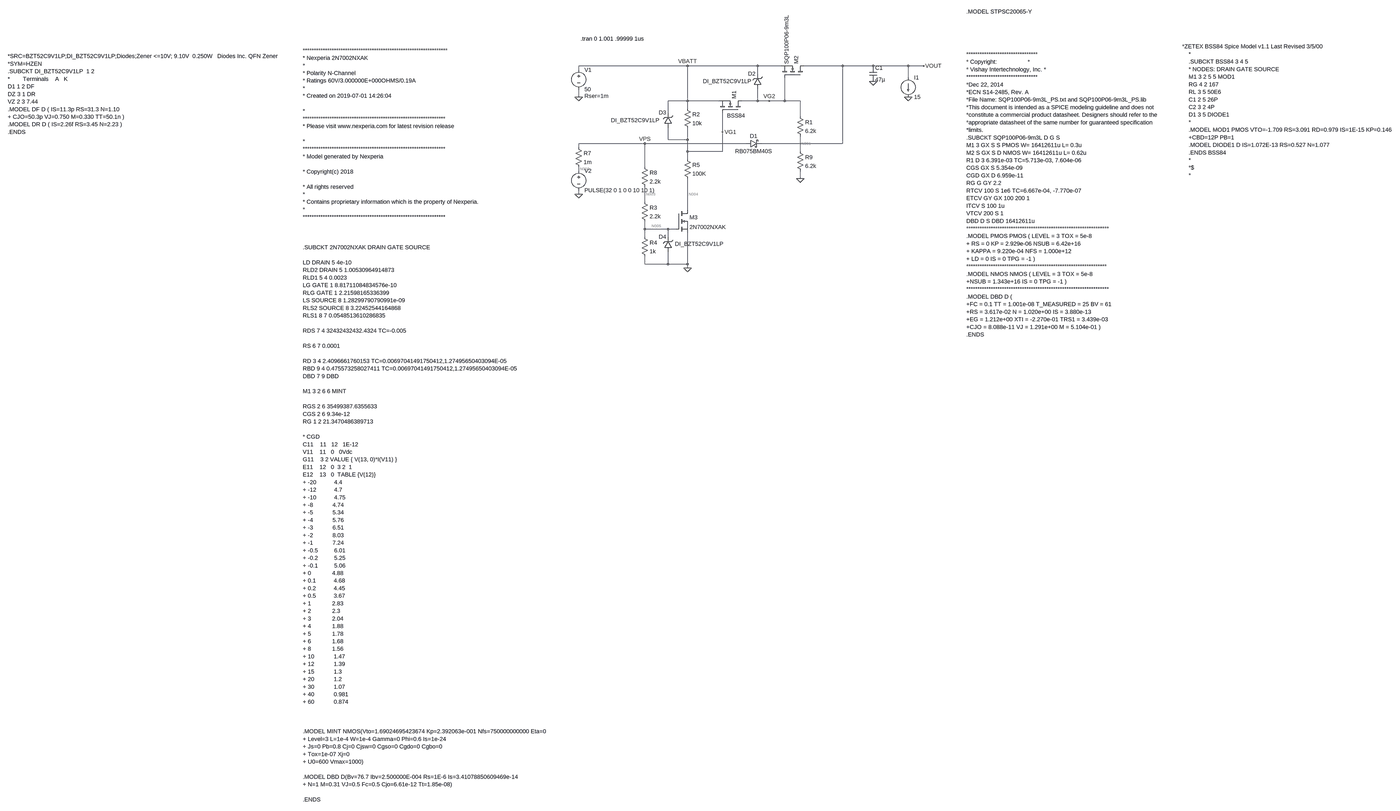
[diagram p0: schematic switching_scheme.asc, whole sheet]
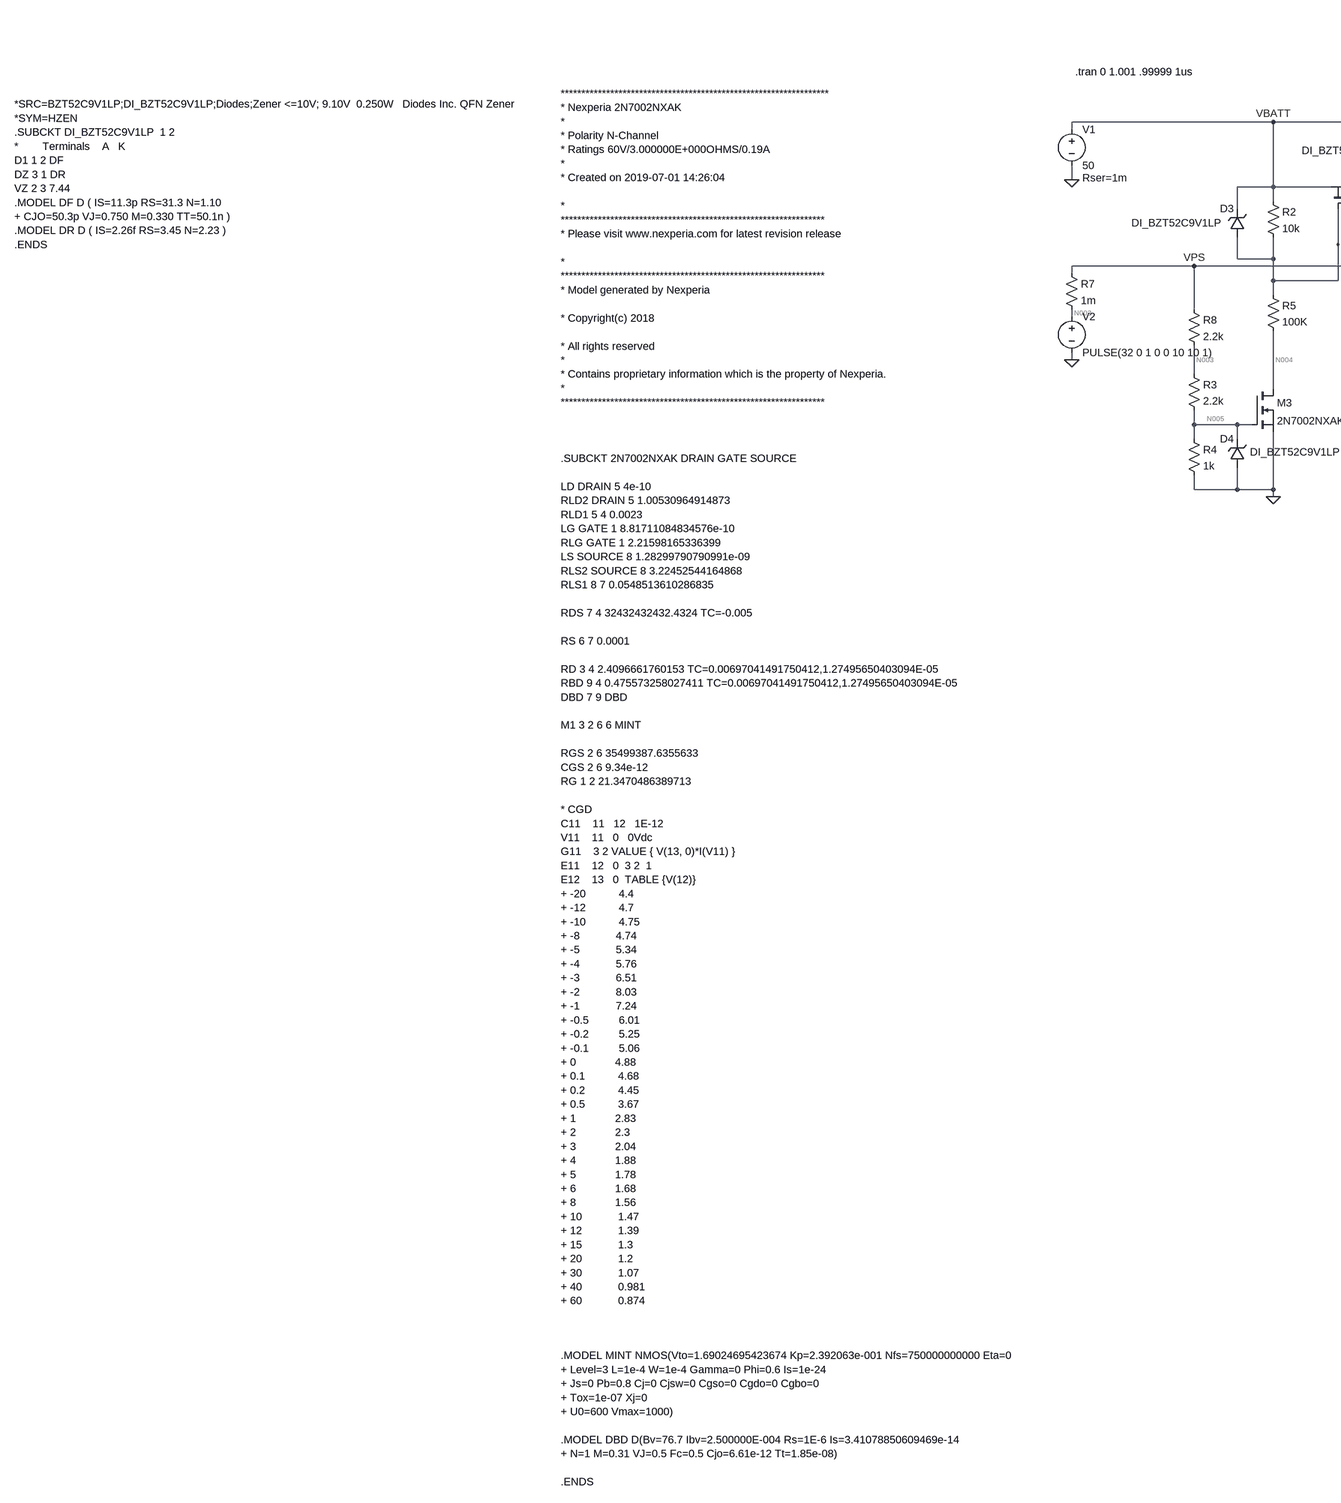
[diagram p1: schematic switching_scheme.asc, part, row 1 of 1, column 1 of 2]
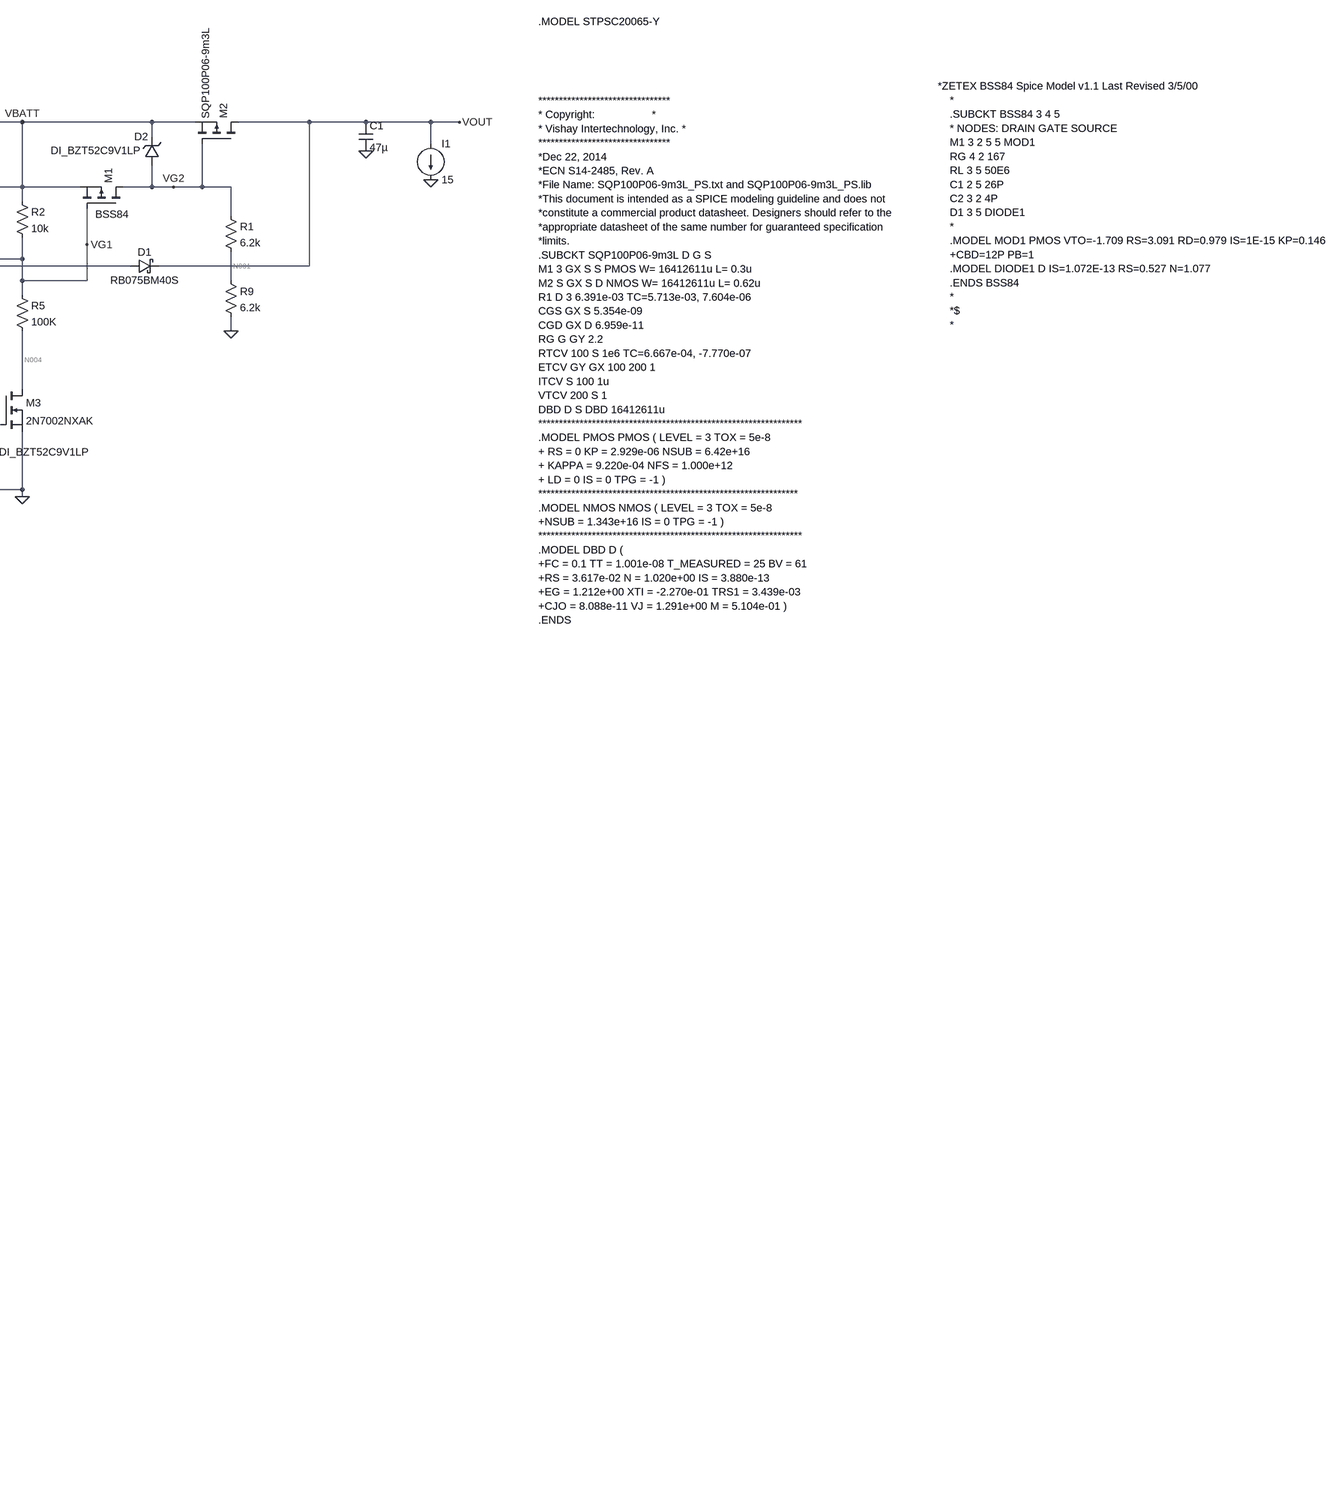
[diagram p2: schematic switching_scheme.asc, part, row 1 of 1, column 2 of 2]
switching_scheme.asc, the LTspice schematic file:
Version 4
SHEET 1 4012 91732
WIRE -176 48 -624 48
WIRE 112 48 -176 48
WIRE 208 48 112 48
WIRE 544 48 304 48
WIRE 688 48 544 48
WIRE 832 48 688 48
WIRE 896 48 832 48
WIRE -624 64 -624 48
WIRE 112 80 112 48
WIRE 832 96 832 48
WIRE -624 176 -624 144
WIRE -176 192 -176 48
WIRE -176 192 -256 192
WIRE -48 192 -176 192
WIRE 112 192 112 144
WIRE 112 192 48 192
WIRE 160 192 112 192
WIRE 224 192 224 96
WIRE 224 192 160 192
WIRE 288 192 224 192
WIRE -176 224 -176 192
WIRE -256 240 -256 192
WIRE 288 256 288 192
WIRE -32 320 -32 240
WIRE -256 352 -256 304
WIRE -176 352 -176 304
WIRE -176 352 -256 352
WIRE -352 368 -624 368
WIRE 64 368 -352 368
WIRE 544 368 544 48
WIRE 544 368 128 368
WIRE -624 384 -624 368
WIRE -176 400 -176 352
WIRE -32 400 -32 320
WIRE -32 400 -176 400
WIRE 288 400 288 336
WIRE -176 432 -176 400
WIRE -352 464 -352 368
WIRE -624 480 -624 464
WIRE 288 512 288 480
WIRE -624 576 -624 560
WIRE -352 608 -352 544
WIRE -176 640 -176 512
WIRE -352 720 -352 688
WIRE -256 720 -352 720
WIRE -224 720 -256 720
WIRE -352 752 -352 720
WIRE -256 752 -256 720
WIRE -352 864 -352 832
WIRE -256 864 -256 816
WIRE -256 864 -352 864
WIRE -176 864 -176 736
WIRE -176 864 -256 864
WIRE -176 880 -176 864
FLAG -176 880 0
FLAG 288 512 0
FLAG -624 576 0
FLAG -624 176 0
FLAG 896 48 VOUT
FLAG -176 48 VBATT
FLAG -352 368 VPS
FLAG 832 176 0
FLAG 160 192 VG2
FLAG -32 320 VG1
FLAG 688 112 0
DATAFLAG 16 368 ""
DATAFLAG 560 48 ""
DATAFLAG 128 48 ""
DATAFLAG 288 192 ""
DATAFLAG -160 192 ""
DATAFLAG -176 848 ""
DATAFLAG -336 720 ""
DATAFLAG -176 400 ""
DATAFLAG 288 512 ""
SYMBOL res 272 240 R0
SYMATTR InstName R1
SYMATTR Value 6.2k
SYMBOL res -192 208 R0
SYMATTR InstName R2
SYMATTR Value 10k
SYMBOL res -368 592 R0
SYMATTR InstName R3
SYMATTR Value 2.2k
SYMBOL res -368 736 R0
SYMATTR InstName R4
SYMATTR Value 1k
SYMBOL voltage -624 464 R0
WINDOW 123 0 0 Left 0
WINDOW 39 0 0 Left 0
SYMATTR InstName V2
SYMATTR Value PULSE(32 0 1 0 0 10 10 1)
SYMBOL pmos 304 96 M270
SYMATTR InstName M2
SYMATTR Value SQP100P06-9m3L
SYMATTR Prefix X
SYMBOL schottky 64 384 R270
WINDOW 0 32 32 VTop 2
WINDOW 3 0 32 VBottom 2
SYMATTR InstName D1
SYMATTR Value RB075BM40S
SYMATTR Description Diode
SYMATTR Type diode
SYMBOL pmos 48 240 M270
WINDOW 3 -13 62 VLeft 2
SYMATTR Value BSS84
SYMATTR InstName M1
SYMATTR Prefix X
SYMBOL voltage -624 48 R0
WINDOW 123 0 0 Left 0
WINDOW 39 24 124 Left 2
SYMATTR SpiceLine Rser=1m
SYMATTR InstName V1
SYMATTR Value 50
SYMBOL nmos -224 640 R0
SYMATTR InstName M3
SYMATTR Value 2N7002NXAK
SYMATTR Prefix X
SYMBOL zener 128 144 R180
WINDOW 0 24 64 Left 2
WINDOW 3 41 33 Left 2
SYMATTR InstName D2
SYMATTR Value DI_BZT52C9V1LP
SYMATTR Prefix X
SYMBOL zener -240 304 R180
WINDOW 0 24 64 Left 2
WINDOW 3 52 32 Left 2
SYMATTR InstName D3
SYMATTR Value DI_BZT52C9V1LP
SYMATTR Prefix X
SYMBOL zener -240 816 R180
WINDOW 0 24 64 Left 2
WINDOW 3 -212 35 Left 2
SYMATTR InstName D4
SYMATTR Value DI_BZT52C9V1LP
SYMATTR Prefix X
SYMBOL res -192 416 R0
SYMATTR InstName R5
SYMATTR Value 100K
SYMBOL res -640 368 R0
SYMATTR InstName R7
SYMATTR Value 1m
SYMBOL cap 672 48 R0
SYMATTR InstName C1
SYMATTR Value 47µ
SYMBOL res -368 448 R0
SYMATTR InstName R8
SYMATTR Value 2.2k
SYMBOL res 272 384 R0
SYMATTR InstName R9
SYMATTR Value 6.2k
SYMBOL current 832 96 R0
WINDOW 123 0 0 Left 0
WINDOW 39 0 0 Left 0
SYMATTR InstName I1
SYMATTR Value 15
TEXT -616 -64 Left 2 !.tran 0 1.001 .99999 1us
TEXT 1128 0 Left 2 !********************************\n* Copyright:                   *\n* Vishay Intertechnology, Inc. *\n********************************\n*Dec 22, 2014\n*ECN S14-2485, Rev. A\n*File Name: SQP100P06-9m3L_PS.txt and SQP100P06-9m3L_PS.lib\n*This document is intended as a SPICE modeling guideline and does not\n*constitute a commercial product datasheet. Designers should refer to the\n*appropriate datasheet of the same number for guaranteed specification\n*limits.\n.SUBCKT SQP100P06-9m3L D G S \nM1 3 GX S S PMOS W= 16412611u L= 0.3u \nM2 S GX S D NMOS W= 16412611u L= 0.62u \nR1 D 3 6.391e-03 TC=5.713e-03, 7.604e-06 \nCGS GX S 5.354e-09 \nCGD GX D 6.959e-11 \nRG G GY 2.2\nRTCV 100 S 1e6 TC=6.667e-04, -7.770e-07 \nETCV GY GX 100 200 1 \nITCV S 100 1u \nVTCV 200 S 1 \nDBD D S DBD 16412611u \n**************************************************************** \n.MODEL PMOS PMOS ( LEVEL = 3 TOX = 5e-8 \n+ RS = 0 KP = 2.929e-06 NSUB = 6.42e+16 \n+ KAPPA = 9.220e-04 NFS = 1.000e+12 \n+ LD = 0 IS = 0 TPG = -1 ) \n*************************************************************** \n.MODEL NMOS NMOS ( LEVEL = 3 TOX = 5e-8 \n+NSUB = 1.343e+16 IS = 0 TPG = -1 ) \n**************************************************************** \n.MODEL DBD D ( \n+FC = 0.1 TT = 1.001e-08 T_MEASURED = 25 BV = 61 \n+RS = 3.617e-02 N = 1.020e+00 IS = 3.880e-13 \n+EG = 1.212e+00 XTI = -2.270e-01 TRS1 = 3.439e-03 \n+CJO = 8.088e-11 VJ = 1.291e+00 M = 5.104e-01 ) \n.ENDS
TEXT 1128 -176 Left 2 !.MODEL STPSC20065-Y
TEXT -1776 -16 Left 2 !*****************************************************************\n* Nexperia 2N7002NXAK\n*\n* Polarity N-Channel\n* Ratings 60V/3.000000E+000OHMS/0.19A\n*\n* Created on 2019-07-01 14:26:04 \n \n*\n****************************************************************\n* Please visit www.nexperia.com for latest revision release\n \n*\n****************************************************************\n* Model generated by Nexperia\n \n* Copyright(c) 2018\n \n* All rights reserved\n*\n* Contains proprietary information which is the property of Nexperia.\n*\n****************************************************************\n \n\n \n.SUBCKT 2N7002NXAK DRAIN GATE SOURCE\n \nLD DRAIN 5 4e-10\nRLD2 DRAIN 5 1.00530964914873\nRLD1 5 4 0.0023\nLG GATE 1 8.81711084834576e-10\nRLG GATE 1 2.21598165336399\nLS SOURCE 8 1.28299790790991e-09\nRLS2 SOURCE 8 3.22452544164868\nRLS1 8 7 0.0548513610286835\n \nRDS 7 4 32432432432.4324 TC=-0.005\n \nRS 6 7 0.0001\n \nRD 3 4 2.4096661760153 TC=0.00697041491750412,1.27495650403094E-05\nRBD 9 4 0.475573258027411 TC=0.00697041491750412,1.27495650403094E-05\nDBD 7 9 DBD\n \nM1 3 2 6 6 MINT\n \nRGS 2 6 35499387.6355633\nCGS 2 6 9.34e-12\nRG 1 2 21.3470486389713\n \n* CGD\nC11    11   12   1E-12\nV11    11   0   0Vdc\nG11    3 2 VALUE { V(13, 0)*I(V11) }\nE11    12   0  3 2  1\nE12    13   0  TABLE {V(12)}\n+ -20           4.4\n+ -12           4.7\n+ -10           4.75\n+ -8            4.74\n+ -5            5.34\n+ -4            5.76\n+ -3            6.51\n+ -2            8.03\n+ -1            7.24\n+ -0.5          6.01\n+ -0.2          5.25\n+ -0.1          5.06\n+ 0             4.88\n+ 0.1           4.68\n+ 0.2           4.45\n+ 0.5           3.67\n+ 1             2.83\n+ 2             2.3\n+ 3             2.04\n+ 4             1.88\n+ 5             1.78\n+ 6             1.68\n+ 8             1.56\n+ 10            1.47\n+ 12            1.39\n+ 15            1.3\n+ 20            1.2\n+ 30            1.07\n+ 40            0.981\n+ 60            0.874\n \n\n \n.MODEL MINT NMOS(Vto=1.69024695423674 Kp=2.392063e-001 Nfs=750000000000 Eta=0\n+ Level=3 L=1e-4 W=1e-4 Gamma=0 Phi=0.6 Is=1e-24\n+ Js=0 Pb=0.8 Cj=0 Cjsw=0 Cgso=0 Cgdo=0 Cgbo=0\n+ Tox=1e-07 Xj=0\n+ U0=600 Vmax=1000)\n \n.MODEL DBD D(Bv=76.7 Ibv=2.500000E-004 Rs=1E-6 Is=3.41078850609469e-14\n+ N=1 M=0.31 VJ=0.5 Fc=0.5 Cjo=6.61e-12 Tt=1.85e-08)\n \n.ENDS
TEXT 2256 -32 Left 2 !*ZETEX BSS84 Spice Model v1.1 Last Revised 3/5/00\n    *              \n    .SUBCKT BSS84 3 4 5\n    * NODES: DRAIN GATE SOURCE\n    M1 3 2 5 5 MOD1\n    RG 4 2 167\n    RL 3 5 50E6\n    C1 2 5 26P\n    C2 3 2 4P \n    D1 3 5 DIODE1\n    *\n    .MODEL MOD1 PMOS VTO=-1.709 RS=3.091 RD=0.979 IS=1E-15 KP=0.146\n    +CBD=12P PB=1\n    .MODEL DIODE1 D IS=1.072E-13 RS=0.527 N=1.077\n    .ENDS BSS84\n    *\n    *$\n    *
TEXT -3072 8 Left 2 !*SRC=BZT52C9V1LP;DI_BZT52C9V1LP;Diodes;Zener <=10V; 9.10V  0.250W   Diodes Inc. QFN Zener\n*SYM=HZEN\n.SUBCKT DI_BZT52C9V1LP  1 2\n*        Terminals    A   K\nD1 1 2 DF\nDZ 3 1 DR\nVZ 2 3 7.44\n.MODEL DF D ( IS=11.3p RS=31.3 N=1.10\n+ CJO=50.3p VJ=0.750 M=0.330 TT=50.1n )\n.MODEL DR D ( IS=2.26f RS=3.45 N=2.23 )\n.ENDS

The netlist it stands for:
* switching_scheme.asc
R1 VG2 N001 6.2k
R2 VBATT VG1 10k
R3 N003 N005 2.2k
R4 N005 0 1k
V2 N002 0 PULSE(32 0 1 0 0 10 10 1)
XM2 VOUT VG2 VBATT SQP100P06-9m3L  ; pins D G S
D1 VPS VOUT RB075BM40S
XM1 VG2 VG1 VBATT BSS84  ; pins D G S
V1 VBATT 0 50 Rser=1m
XM3 N004 N005 0 2N7002NXAK  ; pins D G S
XD2 VG2 VBATT DI_BZT52C9V1LP  ; pins + -
XD3 VG1 VBATT DI_BZT52C9V1LP  ; pins + -
XD4 0 N005 DI_BZT52C9V1LP  ; pins + -
R5 VG1 N004 100K
R7 VPS N002 1m
C1 VOUT 0 47µ
R8 VPS N003 2.2k
R9 N001 0 6.2k
I1 VOUT 0 15
.model D D
.lib standard.dio
.tran 0 1.001 .99999 1us
********************************
* Copyright:                   *
* Vishay Intertechnology, Inc. *
********************************
*Dec 22, 2014
*ECN S14-2485, Rev. A
*File Name: SQP100P06-9m3L_PS.txt and SQP100P06-9m3L_PS.lib
*This document is intended as a SPICE modeling guideline and does not
*constitute a commercial product datasheet. Designers should refer to the
*appropriate datasheet of the same number for guaranteed specification
*limits.
.SUBCKT SQP100P06-9m3L D G S
M1 3 GX S S PMOS W= 16412611u L= 0.3u
M2 S GX S D NMOS W= 16412611u L= 0.62u
R1 D 3 6.391e-03 TC=5.713e-03, 7.604e-06
CGS GX S 5.354e-09
CGD GX D 6.959e-11
RG G GY 2.2
RTCV 100 S 1e6 TC=6.667e-04, -7.770e-07
ETCV GY GX 100 200 1
ITCV S 100 1u
VTCV 200 S 1
DBD D S DBD 16412611u
****************************************************************
.MODEL PMOS PMOS ( LEVEL = 3 TOX = 5e-8
+ RS = 0 KP = 2.929e-06 NSUB = 6.42e+16
+ KAPPA = 9.220e-04 NFS = 1.000e+12
+ LD = 0 IS = 0 TPG = -1 )
***************************************************************
.MODEL NMOS NMOS ( LEVEL = 3 TOX = 5e-8
+NSUB = 1.343e+16 IS = 0 TPG = -1 )
****************************************************************
.MODEL DBD D (
+FC = 0.1 TT = 1.001e-08 T_MEASURED = 25 BV = 61
+RS = 3.617e-02 N = 1.020e+00 IS = 3.880e-13
+EG = 1.212e+00 XTI = -2.270e-01 TRS1 = 3.439e-03
+CJO = 8.088e-11 VJ = 1.291e+00 M = 5.104e-01 )
.ENDS
.MODEL STPSC20065-Y
*****************************************************************
* Nexperia 2N7002NXAK
*
* Polarity N-Channel
* Ratings 60V/3.000000E+000OHMS/0.19A
*
* Created on 2019-07-01 14:26:04
*
****************************************************************
* Please visit www.nexperia.com for latest revision release
*
****************************************************************
* Model generated by Nexperia
* Copyright(c) 2018
* All rights reserved
*
* Contains proprietary information which is the property of Nexperia.
*
****************************************************************
.SUBCKT 2N7002NXAK DRAIN GATE SOURCE
LD DRAIN 5 4e-10
RLD2 DRAIN 5 1.00530964914873
RLD1 5 4 0.0023
LG GATE 1 8.81711084834576e-10
RLG GATE 1 2.21598165336399
LS SOURCE 8 1.28299790790991e-09
RLS2 SOURCE 8 3.22452544164868
RLS1 8 7 0.0548513610286835
RDS 7 4 32432432432.4324 TC=-0.005
RS 6 7 0.0001
RD 3 4 2.4096661760153 TC=0.00697041491750412,1.27495650403094E-05
RBD 9 4 0.475573258027411 TC=0.00697041491750412,1.27495650403094E-05
DBD 7 9 DBD
M1 3 2 6 6 MINT
RGS 2 6 35499387.6355633
CGS 2 6 9.34e-12
RG 1 2 21.3470486389713
* CGD
C11    11   12   1E-12
V11    11   0   0Vdc
G11    3 2 VALUE { V(13, 0)*I(V11) }
E11    12   0  3 2  1
E12    13   0  TABLE {V(12)}
+ -20           4.4
+ -12           4.7
+ -10           4.75
+ -8            4.74
+ -5            5.34
+ -4            5.76
+ -3            6.51
+ -2            8.03
+ -1            7.24
+ -0.5          6.01
+ -0.2          5.25
+ -0.1          5.06
+ 0             4.88
+ 0.1           4.68
+ 0.2           4.45
+ 0.5           3.67
+ 1             2.83
+ 2             2.3
+ 3             2.04
+ 4             1.88
+ 5             1.78
+ 6             1.68
+ 8             1.56
+ 10            1.47
+ 12            1.39
+ 15            1.3
+ 20            1.2
+ 30            1.07
+ 40            0.981
+ 60            0.874
.MODEL MINT NMOS(Vto=1.69024695423674 Kp=2.392063e-001 Nfs=750000000000 Eta=0
+ Level=3 L=1e-4 W=1e-4 Gamma=0 Phi=0.6 Is=1e-24
+ Js=0 Pb=0.8 Cj=0 Cjsw=0 Cgso=0 Cgdo=0 Cgbo=0
+ Tox=1e-07 Xj=0
+ U0=600 Vmax=1000)
.MODEL DBD D(Bv=76.7 Ibv=2.500000E-004 Rs=1E-6 Is=3.41078850609469e-14
+ N=1 M=0.31 VJ=0.5 Fc=0.5 Cjo=6.61e-12 Tt=1.85e-08)
.ENDS
*ZETEX BSS84 Spice Model v1.1 Last Revised 3/5/00
    *
    .SUBCKT BSS84 3 4 5
    * NODES: DRAIN GATE SOURCE
    M1 3 2 5 5 MOD1
    RG 4 2 167
    RL 3 5 50E6
    C1 2 5 26P
    C2 3 2 4P
    D1 3 5 DIODE1
    *
    .MODEL MOD1 PMOS VTO=-1.709 RS=3.091 RD=0.979 IS=1E-15 KP=0.146
    +CBD=12P PB=1
    .MODEL DIODE1 D IS=1.072E-13 RS=0.527 N=1.077
    .ENDS BSS84
    *
    *$
    *
*SRC=BZT52C9V1LP;DI_BZT52C9V1LP;Diodes;Zener <=10V; 9.10V  0.250W   Diodes Inc. QFN Zener
*SYM=HZEN
.SUBCKT DI_BZT52C9V1LP  1 2
*        Terminals    A   K
D1 1 2 DF
DZ 3 1 DR
VZ 2 3 7.44
.MODEL DF D ( IS=11.3p RS=31.3 N=1.10
+ CJO=50.3p VJ=0.750 M=0.330 TT=50.1n )
.MODEL DR D ( IS=2.26f RS=3.45 N=2.23 )
.ENDS
.backanno
.end

* Results of the author's LTspice run, read from the files saved beside the schematic
* Operating Point, zero values left out:
*   V(vg2) = 49.97 V
*   V(n001) = 24.99 V
*   V(vbatt) = 50 V
*   V(vg1) = 45.45 V
*   V(n003) = 18.95 V
*   V(n005) = 5.923 V
*   V(n002) = 32 V
*   V(vout) = 31.01 V
*   V(vps) = 31.98 V
*   V(n004) = 1.571 mV
*   I(D1) = 15 A
*   I(I1) = 15 A
*   I(R9) = 4.03 mA
*   I(R8) = 5.923 mA
*   I(R7) = -15.01 A
*   I(R5) = 454.5 µA
*   I(R4) = 5.923 mA
*   I(R3) = 5.923 mA
*   I(R2) = 454.5 µA
*   I(R1) = 4.03 mA
*   I(V1) = -4.485 mA
*   I(V2) = -15.01 A
*   Ix(m2:D) = -110.8 pA
*   Ix(m2:S) = 110.9 pA
*   Ix(m1:3) = -4.03 mA
*   Ix(m1:5) = 4.03 mA
*   Ix(m3:DRAIN) = 454.5 µA
*   Ix(m3:GATE) = 166.8 nA
*   Ix(m3:SOURCE) = -454.7 µA
*   Ix(d3:1) = -12.95 pA
*   Ix(d3:2) = 23.12 pA
*   Ix(d4:1) = -15.7 pA
*   Ix(d4:2) = 15.7 pA
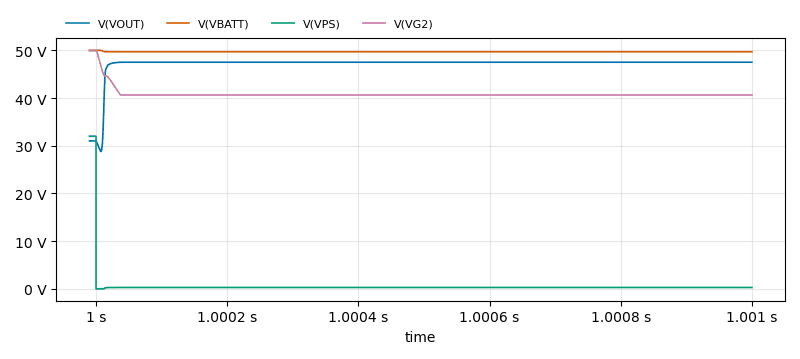
[diagram p3: Transient Analysis of switching_scheme.asc, plotted from the saved traces]
* Transient Analysis, 1 run:
*   V(VOUT): min 28.79 V, max 47.51 V, average 47.13 V, rms 47.19 V, last 47.51 V
*   V(VBATT): min 49.71 V, max 50 V, average 49.71 V, rms 49.71 V, last 49.71 V
*   V(VPS): min -67.65 µV, max 31.98 V, average 589.7 mV, rms 3.195 V, last 279.8 mV
*   V(VG2): min 40.64 V, max 49.97 V, average 40.87 V, rms 40.89 V, last 40.64 V